# Altium schematic sheet SHEET2.SCHDOC
size A4
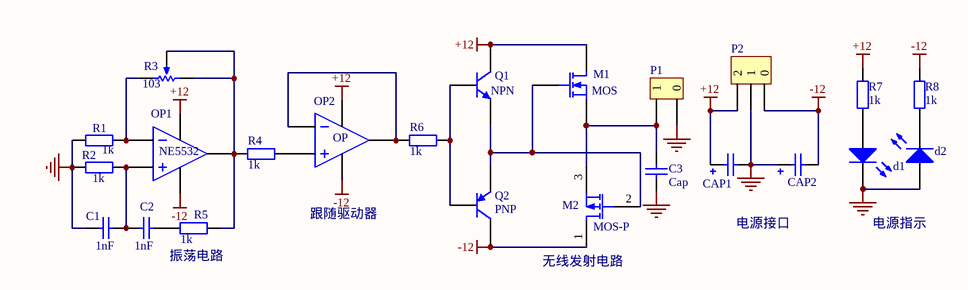
[diagram p0: SHEET2.SCHDOC]

## Parts
C1  1nF  [Cap]
C2  1nF  [Cap]
C3  Cap  [C]
CAP1  电解小电容  [电解小电容]  (value not drawn)
CAP2  电解小电容  [电解小电容]  (value not drawn)
d1  LED  [LED]  (value not drawn)
d2  LED  [LED]  (value not drawn)
M1  MOS  [MOS1]
M2  MOS-P  [MOS-P]
OP1  NE5532  [OP]
OP2  OP  [OP]
P1  双孔压线器  [双孔压线器]  (value not drawn)
P2  三脚压线器  [三脚压线器]  (value not drawn)
Q1  NPN  [npn - duplicate]
Q2  PNP  [pnp - duplicate]
R1  电阻  [电阻]  (value not drawn)
R2  电阻  [电阻]  (value not drawn)
R3  滑动变阻器  [滑动变阻器]  (value not drawn)
R4  电阻  [电阻]  (value not drawn)
R5  电阻  [电阻]  (value not drawn)
R6  电阻  [电阻]  (value not drawn)
R7  电阻  [电阻]  (value not drawn)
R8  电阻  [电阻]  (value not drawn)

## Nets
+12: CAP1.2 M1.1(D) OP1.4 OP2.4 P2.2 Q1.1(C) R7.2
-12: CAP2.1 M2.1(D) OP1.3 OP2.3 P2.0 Q2.1(C) R8.2
GND: C1.2 C3.2 CAP1.1 CAP2.2 d1.2(K) d2.1(A) P1.0 P2.1 R1.1 R2.2
NetC1_1: C1.1 C2.1 OP1.2 R2.1
NetC2_2: C2.2 R5.1
NetC3_1: C3.1 M1.3(S) M2.3(S) P1.1
Netd1_1: d1.1(A) R7.1
Netd2_2: d2.2(K) R8.1
NetM1_2: M1.2(G) M2.2(G) Q1.3(E) Q2.3(E)
NetOP1_1: OP1.1 R1.2 R3.2(BOT)
NetOP1_5: OP1.5 R3.1(TOP) R3.3(TAP) R4.1 R5.2
NetOP2_1: OP2.1 OP2.5 R6.1
NetOP2_2: OP2.2 R4.2
NetQ1_2: Q1.2(B) Q2.2(B) R6.2

## Notes on the sheet
- 跟随驱动器
- 振荡电路
- (near M2) 无线发射电路
- 电源接口
- 电源指示
- (in symbol 滑动变阻器) 103
- (in symbol 电阻) 1k

## Library data of the parts
C1 C2 = Cap
OP1 = OP